# Altium schematic sheet ESP12E.SchDoc
size A4
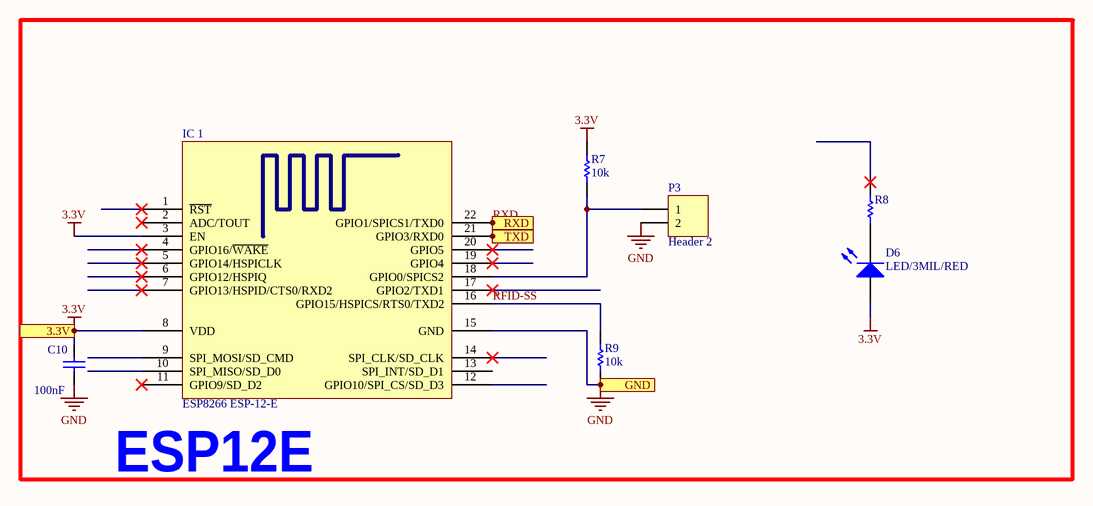
[diagram p0: ESP12E.SchDoc]

## Parts
C10  100nF  [0805 - CAP]
D6  LED/3MIL/RED  [Led_3mil -2 - duplicate]
IC_1  ESP8266 ESP-12-E  [ESP8266 ESP-12-E]
P3  Header 2  [HDR1X2]
R7  10k  [0805/resistor]
R8  470R  [0805/resistor]  (value not drawn)
R9  10k  [0805/resistor]

## Ports
3.3V, GND, RXD, TXD

## Nets
3.3V: C10.2 D6.1(A) IC_1.3(EN) IC_1.8(VDD) R7.2 ; port 3.3V
GND: C10.1 IC_1.15(GND) P3.2 R9.1 ; port GND
RFID-SS: IC_1.16(GPIO15/HSPICS/RTS0/TXD2) R9.2
RXD: IC_1.22(GPIO1/SPICS1/TXD0) ; port RXD
TXD: IC_1.21(GPIO3/RXD0) ; port TXD
NetD6_2: D6.2(K) R8.1
NetIC_1_18: IC_1.18(GPIO0/SPICS2) P3.1 R7.1

Not connected (* = marked no-connect by the designer): IC_1 1(~{RST})* 2(ADC/TOUT)* 4(GPIO16/~{WAKE})* 5(GPIO14/HSPICLK)* 6(GPIO12/HSPIQ)* 7(GPIO13/HSPID/CTS0/RXD2)* 9(SPI_MOSI/SD_CMD) 10(SPI_MISO/SD_D0) 11(GPIO9/SD_D2)* 12(GPIO10/SPI_CS/SD_D3) 13(SPI_INT/SD_D1) 14(SPI_CLK/SD_CLK)* 17(GPIO2/TXD1)* 19(GPIO4)* 20(GPIO5)*; R8 2*

## Notes on the sheet
- (near IC_1) ESP12E

## Library data of the parts
C10 = Cap: Capacitor; Published: 8-Jun-2000; LatestRevisionDate: 17-Jul-2002; LatestRevisionNote: Re-released for DXP Platform.; PackageReference: RAD-0.3; Publisher: Altium Limited; PackageDescription: Radial Cap, Thru-Hole; 2 Leads; 0.3 in Pin Spacing; Value: 100nF
D6 = LED0: Typical INFRARED GaAs LED; Published: 8-Jun-2000; LatestRevisionDate: 08-Jul-2005; LatestRevisionNote: Mech Layer 1 removed.; PackageReference: LED-0; Publisher: Altium Limited; PackageDescription: LED; 2 Leads
P3 = Header 2: Header, 2-Pin; LatestRevisionDate: 17-Jul-2002; LatestRevisionNote: Re-released for DXP Platform.; Publisher: Altium Limited
R7-R9 = Res1: Resistor; Published: 8-Jun-2000; LatestRevisionDate: 17-Jul-2002; LatestRevisionNote: Re-released for DXP Platform.; PackageReference: AXIAL-0.3; Publisher: Altium Limited; PackageDescription: Axial Device, Thru-Hole; 2 Leads; 0.3 in Pin Spacing
  R7 R9: Value: 10k
  R8: Value: 470R